# EAGLE design controller_singleSided (EAGLE 5.06)
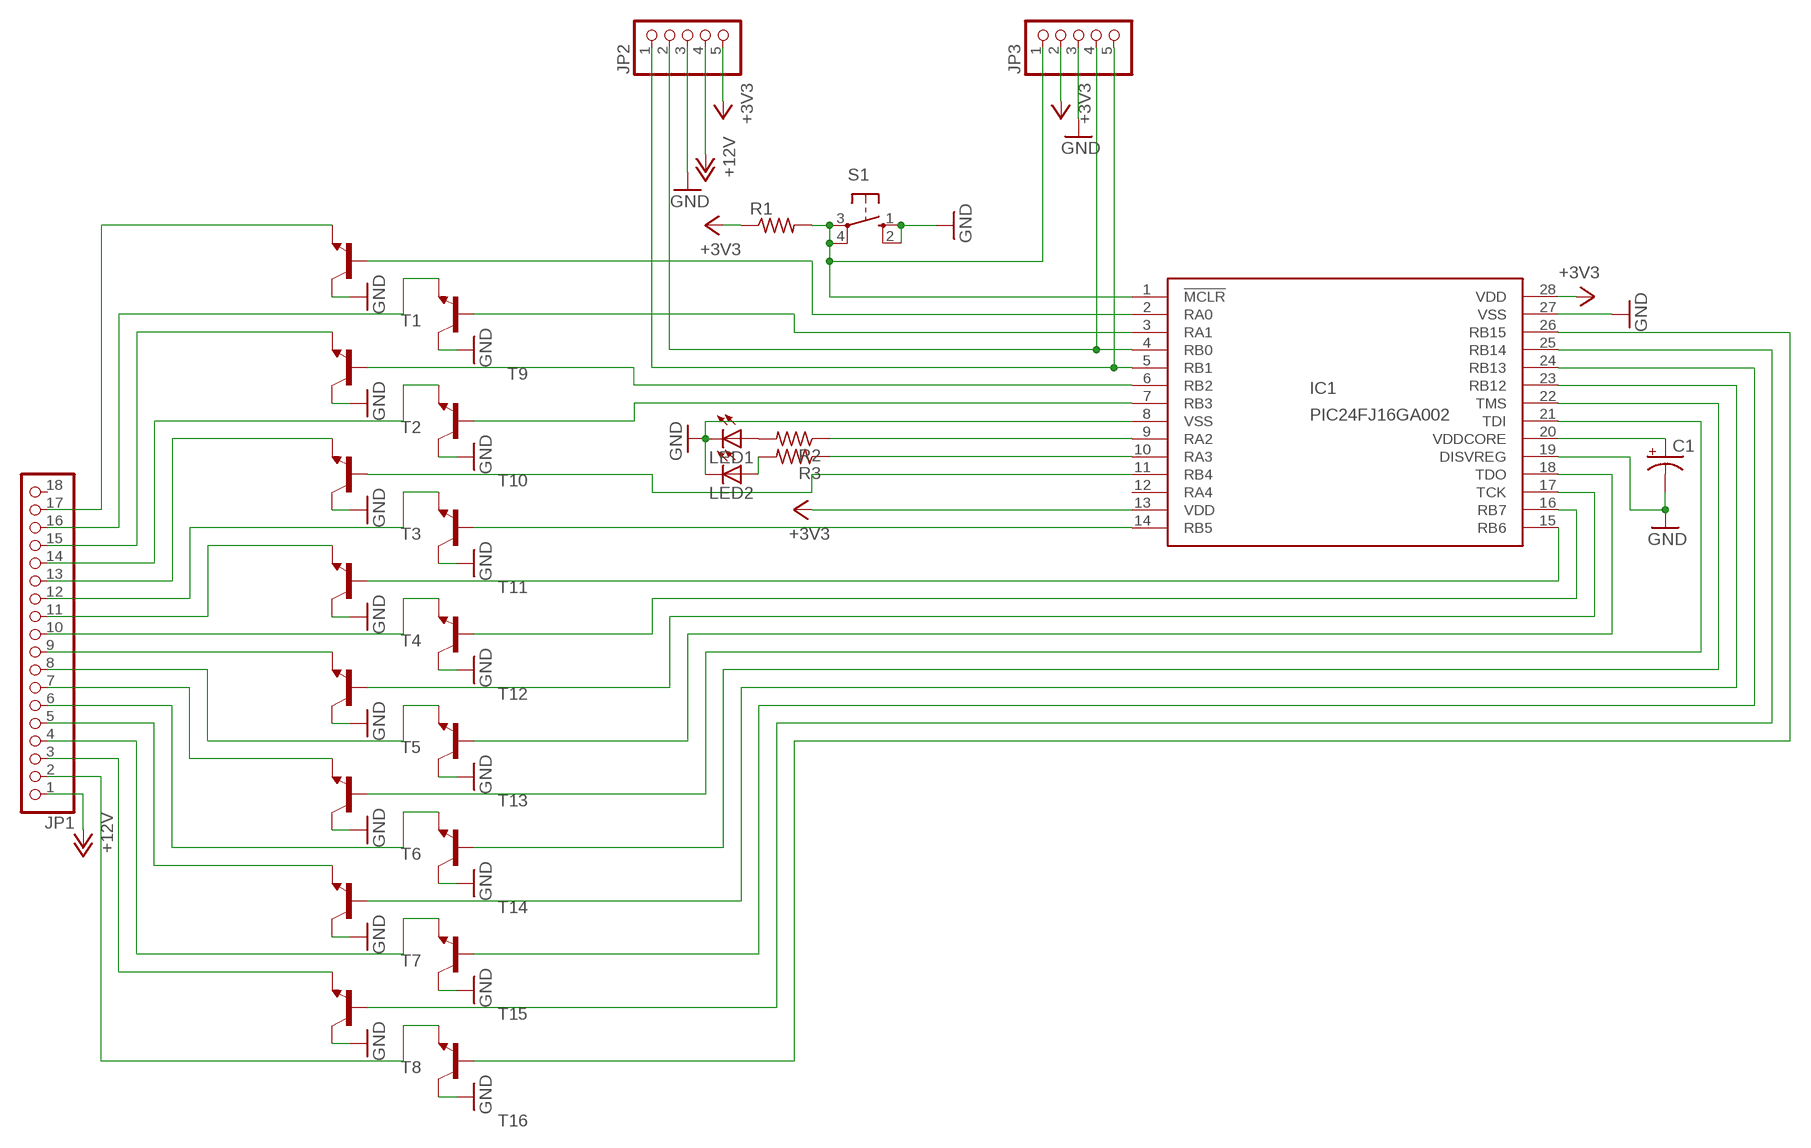
[diagram p0: schematic, sheet 1]

## Parts
C1  CPOL-USE1.8-4  [E1,8-4]
IC1  PIC24FJ16GA002  [DIL28-3]
JP1  PINHD-1X18  [1X18]
JP2  PINHD-1X5  [1X05]
JP3  PINHD-1X5  [1X05]
LED1  LED3MM  [LED3MM]
LED2  LED3MM  [LED3MM]
R1  R-US_0207/10  [0207/10]
R2  R-US_0207/10  [0207/10]
R3  R-US_0207/10  [0207/10]
S1  10-XX  [B3F-10XX]
T1  MPS2222A-NPN-TO92-CBE  [TO92-CBE]
T2  MPS2222A-NPN-TO92-CBE  [TO92-CBE]
T3  MPS2222A-NPN-TO92-CBE  [TO92-CBE]
T4  MPS2222A-NPN-TO92-CBE  [TO92-CBE]
T5  MPS2222A-NPN-TO92-CBE  [TO92-CBE]
T6  MPS2222A-NPN-TO92-CBE  [TO92-CBE]
T7  MPS2222A-NPN-TO92-CBE  [TO92-CBE]
T8  MPS2222A-NPN-TO92-CBE  [TO92-CBE]
T9  MPS2222A-NPN-TO92-CBE  [TO92-CBE]
T10  MPS2222A-NPN-TO92-CBE  [TO92-CBE]
T11  MPS2222A-NPN-TO92-CBE  [TO92-CBE]
T12  MPS2222A-NPN-TO92-CBE  [TO92-CBE]
T13  MPS2222A-NPN-TO92-CBE  [TO92-CBE]
T14  MPS2222A-NPN-TO92-CBE  [TO92-CBE]
T15  MPS2222A-NPN-TO92-CBE  [TO92-CBE]
T16  MPS2222A-NPN-TO92-CBE  [TO92-CBE]

## Nets
+3V3: IC1.13(VDD) IC1.28(VDD) JP2.5 JP3.2 R1.1
+12V: JP1.1 JP2.4
GND: C1.- IC1.8(VSS) IC1.19(DISVREG) IC1.27(VSS) JP2.3 JP3.3 LED1.K(C) LED2.K(C) S1.1(S) S1.2(S1) T1.C T2.C T3.C T4.C T5.C T6.C T7.C T8.C T9.C T10.C T11.C T12.C T13.C T14.C T15.C T16.C
N$1: IC1.2(RA0) T1.B
N$2: IC1.3(RA1) T9.B
N$3: IC1.6(RB2) T2.B
N$4: IC1.7(RB3) T10.B
N$5: IC1.11(RB4) T3.B
N$6: IC1.14(RB5) T11.B
N$7: IC1.15(RB6) T4.B
N$8: IC1.16(RB7) T12.B
N$9: IC1.17(TCK) T5.B
N$10: IC1.18(TDO) T13.B
N$11: IC1.21(TDI) T6.B
N$12: IC1.22(TMS) T14.B
N$13: IC1.23(RB12) T7.B
N$14: IC1.24(RB13) T15.B
N$15: IC1.25(RB14) T8.B
N$16: IC1.26(RB15) T16.B
N$17: JP1.10 T12.E
N$18: JP1.12 T11.E
N$19: JP1.13 T3.E
N$20: JP1.11 T4.E
N$21: JP1.9 T5.E
N$22: JP1.17 T1.E
N$23: JP1.16 T9.E
N$24: JP1.15 T2.E
N$25: JP1.14 T10.E
N$26: JP1.8 T13.E
N$27: JP1.7 T6.E
N$28: JP1.6 T14.E
N$29: JP1.5 T7.E
N$30: JP1.4 T15.E
N$31: JP1.3 T8.E
N$32: JP1.2 T16.E
N$33: IC1.1(!MCLR) JP3.1 R1.2 S1.3(P) S1.4(P1)
N$34: LED1.A R2.2
N$35: IC1.5(RB1) JP2.1 JP3.5
N$36: IC1.4(RB0) JP2.2 JP3.4
N$37: IC1.9(RA2) R2.1
N$38: C1.+ IC1.20(VDDCORE)
N$39: IC1.10(RA3) R3.1
N$40: LED2.A R3.2
Unconnected: IC1.12(RA4) JP1.18

## Library data of the parts
C1 = rcl:CPOL-US: POLARIZED CAPACITOR, American symbol
IC1 = microchip:PIC24FJ16GA002: PIC24FJ16GA002 edit this description Auto generated by make-symbol-device-package-bsdl.ulp Rev. 25 Source: PIC24FJ16GA002.bsd
JP1 = pinhead:PINHD-1X18: PIN HEADER
JP2 JP3 = pinhead:PINHD-1X5: PIN HEADER
LED1 LED2 = led:LED: LED OSRAM: - CHIPLED LG R971, LG N971, LY N971, LG Q971, LY Q971, LO R971, LY R971 LH N974, LH R974 LS Q976, LO Q976, LY Q976 LO Q996 - Hyper CHIPLED LW Q18S LB Q993, LB Q99A, LB R99A - SideLED LS A670, LO A670, LY A670, LG A670, LP A670 LB A673, LV A673, LT A673, LW A673 LH A674 LY A675 LS A676, LA A676, LO A676, LY A676, LW A676 LS A679, LY A679, LG A679 - Hyper Micro SIDELED® LS Y876, LA Y876, LO Y876, LY Y876 LT Y87S - SmartLED LW L88C, LW L88S LB L89C, LB L89S, LG L890 LS L89K, LO L89K, LY L89K LS L896, LA L896, LO L896, LY L896 - TOPLED LS T670, LO T670, LY T670, LG T670, LP T670 LSG T670, LSP T670, LSY T670, LOP T670, LYG T670 LG T671, LOG T671, LSG T671 LB T673, LV T673, LT T673, LW T673 LH T674 LS T676, LA T676, LO T676, LY T676, LB T676, LH T676, LSB T676, LW T676 LB T67C, LV T67C, LT T67C, LS T67K, LO T67K, LY T67K, LW E67C LS E67B, LA E67B, LO E67B, LY E67B, LB E67C, LV E67C, LT E67C LW T67C LS T679, LY T679, LG T679 LS T770, LO T770, LY T770, LG T770, LP T770 LB T773, LV T773, LT T773, LW T773 LH T774 LS E675, LA E675, LY E675, LS T675 LS T776, LA T776, LO T776, LY T776, LB T776 LHGB T686 LT T68C, LB T68C - Hyper Mini TOPLED® LB M676 - Mini TOPLED Santana® LG M470 LS M47K, LO M47K, LY M47K Source: http://www.osram.convergy.de LUXEON: - LUMILED® LXK2-PW12-R00, LXK2-PW12-S00, LXK2-PW14-U00, LXK2-PW14-V00 LXK2-PM12-R00, LXK2-PM12-S00, LXK2-PM14-U00 LXK2-PE12-Q00, LXK2-PE12-R00, LXK2-PE12-S00, LXK2-PE14-T00, LXK2-PE14-U00 LXK2-PB12-K00, LXK2-PB12-L00, LXK2-PB12-M00, LXK2-PB14-N00, LXK2-PB14-P00, LXK2-PB14-Q00 LXK2-PR12-L00, LXK2-PR12-M00, LXK2-PR14-Q00, LXK2-PR14-R00 LXK2-PD12-Q00, LXK2-PD12-R00, LXK2-PD12-S00 LXK2-PH12-R00, LXK2-PH12-S00 LXK2-PL12-P00, LXK2-PL12-Q00, LXK2-PL12-R00 Source: www.luxeon.com KINGBRIGHT: KA-3528ASYC Source: www.kingbright.com
R1-R3 = resistor:R-US_: RESISTOR, American symbol
S1 = switch-omron:10-XX: OMRON SWITCH
T1-T16 = transistor:*-NPN-: NPN Transistror BF959 corrected 2008.03.06

## Board
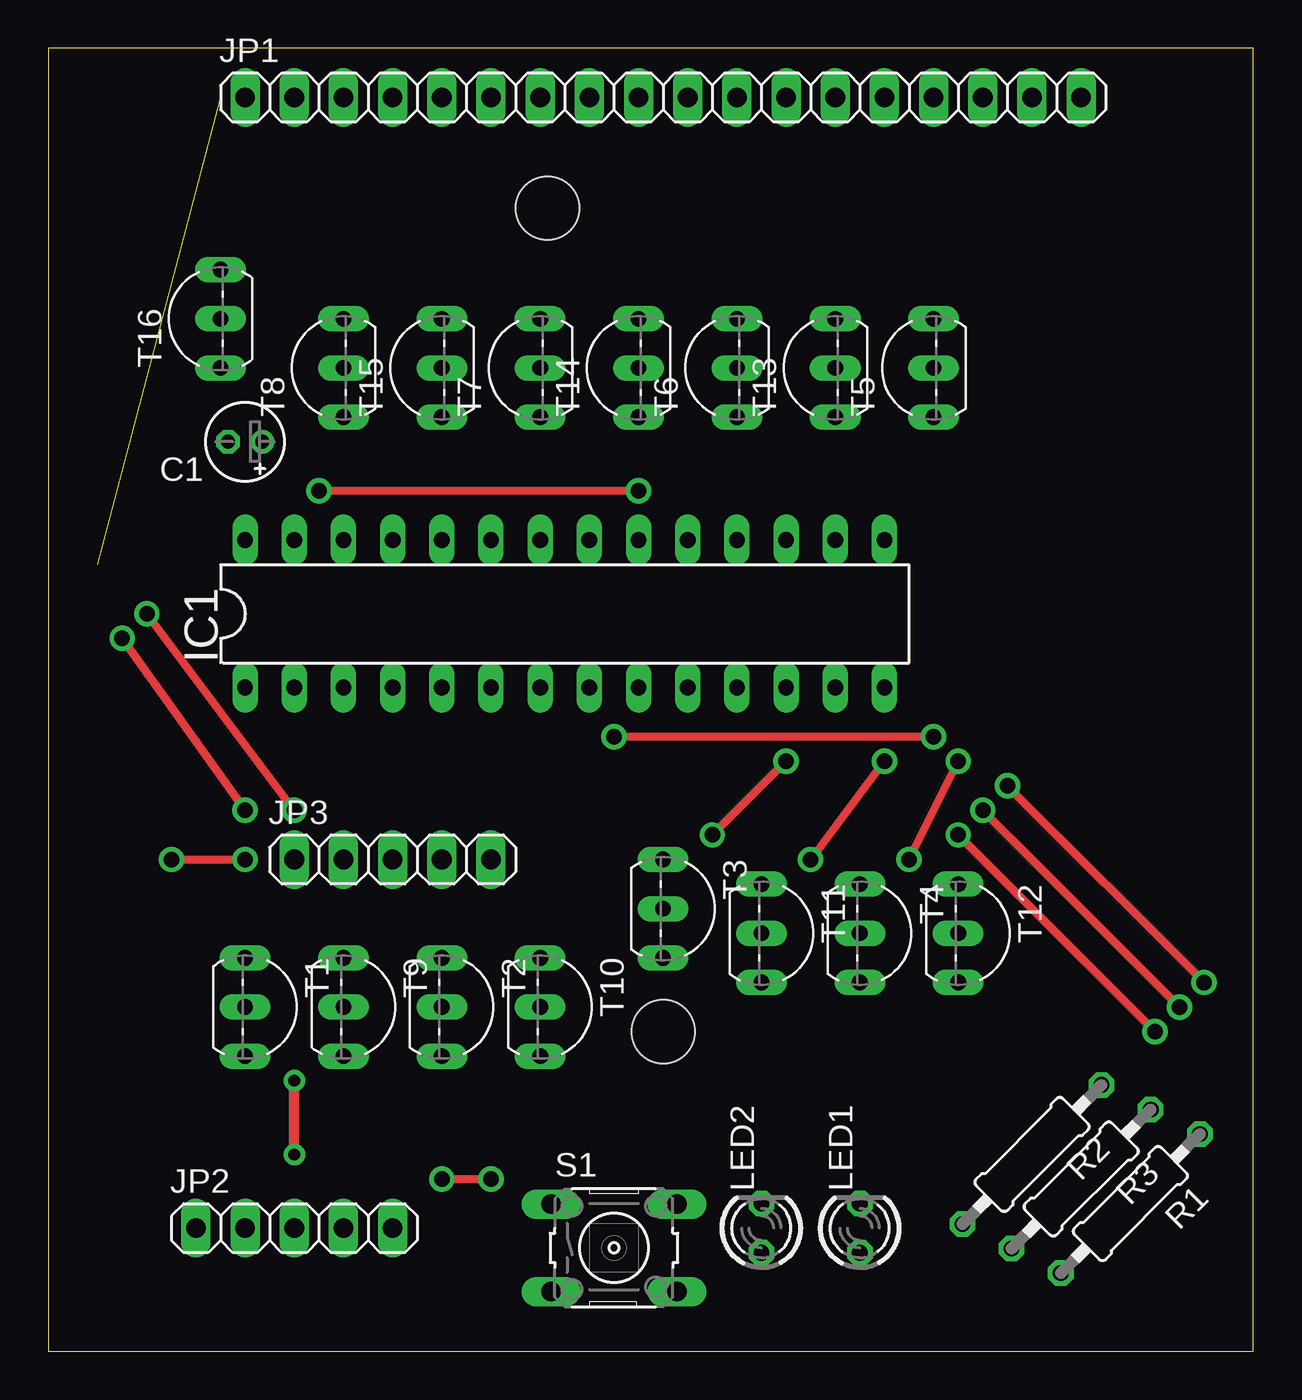
[diagram p1: board, top side]
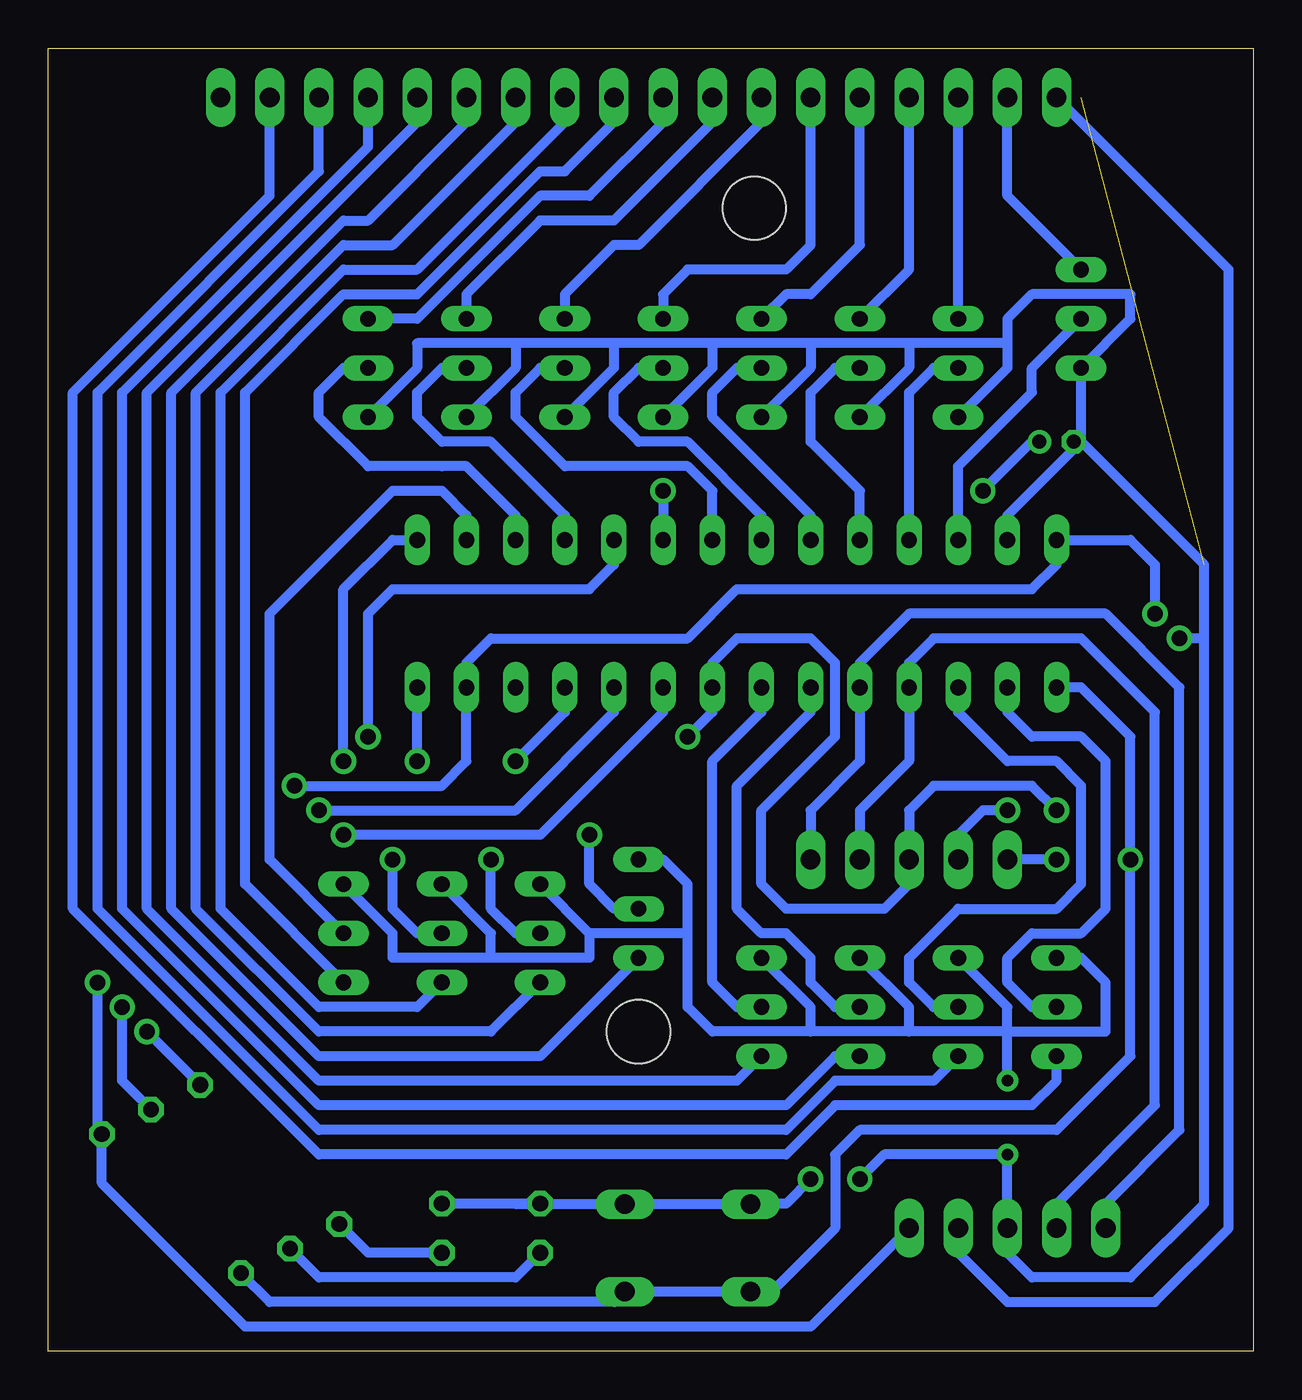
[diagram p2: board, bottom side, seen from below]

Size 62.23 x 67.31 mm. Coordinates in mm from the lower left corner, seen from the top.
Outline: 0,0 62.23,0 62.23,67.31 0,67.31 0,0
Copper layers (1*16): Top 0.035mm / dielectric 1.5mm / Bottom 0.035mm
Design rules "default *": minimum track width 10mil, minimum drill 24mil, track to track 8mil, track to pad 8mil, pad to pad 8mil, via to via 8mil, smd to smd 8mil, copper to edge 40mil, drill to drill 8mil, minimum pad ring 10mil, minimum via ring 10mil, stop-mask expansion 4mil, vias tented up to drill 0mil, thermal gap 10mil
Holes 3.26 mm at 31.75,16.51 25.78,59.05

### Footprints (pad centres in the part's own frame; a part is rotated, then mirrored left to right if it is on the bottom)
E1,8-4 = drill 0.711 pad 1.168 round: + -0.889,0 | drill 0.711 pad 1.168 octagon: - 0.889,0
DIL28-3 = drill 0.813 long: 1 -16.51,-3.81; 2 -13.97,-3.81; 3 -11.43,-3.81; 4 -8.89,-3.81; 5 -6.35,-3.81; 6 -3.81,-3.81; 7 -1.27,-3.81; 8 1.27,-3.81; 9 3.81,-3.81; 10 6.35,-3.81; 11 8.89,-3.81; 12 11.43,-3.81; 13 13.97,-3.81; 14 16.51,-3.81; 15 16.51,3.81; 16 13.97,3.81; 17 11.43,3.81; 18 8.89,3.81; 19 6.35,3.81; 20 3.81,3.81; 21 1.27,3.81; 22 -1.27,3.81; 23 -3.81,3.81; 24 -6.35,3.81; 25 -8.89,3.81; 26 -11.43,3.81; 27 -13.97,3.81; 28 -16.51,3.81
1X18 = drill 1.016 long: 1 -21.59,0; 2 -19.05,0; 3 -16.51,0; 4 -13.97,0; 5 -11.43,0; 6 -8.89,0; 7 -6.35,0; 8 -3.81,0; 9 -1.27,0; 10 1.27,0; 11 3.81,0; 12 6.35,0; 13 8.89,0; 14 11.43,0; 15 13.97,0; 16 16.51,0; 17 19.05,0; 18 21.59,0
1X05 = drill 1.016 long: 1 -5.08,0; 2 -2.54,0; 3 0,0; 4 2.54,0; 5 5.08,0
LED3MM = drill 0.813 octagon: A -1.27,0; K 1.27,0
0207/10 = drill 0.813 octagon: 1 -5.08,0; 2 5.08,0
B3F-10XX = drill 1.016 long: 1 -3.251,2.261; 2 3.251,2.261; 3 -3.251,-2.261; 4 3.251,-2.261
TO92-CBE = drill 0.813 long: B 0,0; C -2.54,0; E 2.54,0

### Placement (x,y rotation side)
C1  10.16,46.99 180 top
IC1  26.67,38.1 0 top
JP1  31.75,64.77 0 top
JP2  12.7,6.35 0 top
JP3  17.78,25.4 0 top
LED1  41.91,6.35 90 top
LED2  36.83,6.35 90 top
R1  55.88,7.62 225 top
R2  50.8,10.16 225 top
R3  53.34,8.89 225 top
S1  29.21,5.33 0 top
T1  10.16,17.78 270 top
T2  20.32,17.78 270 top
T3  31.75,22.86 270 top
T4  41.91,21.59 270 top
T5  45.72,50.8 90 top
T6  35.56,50.8 90 top
T7  25.4,50.8 90 top
T8  15.24,50.8 90 top
T9  15.24,17.78 270 top
T10  25.4,17.78 270 top
T11  36.83,21.59 270 top
T12  46.99,21.59 270 top
T13  40.64,50.8 90 top
T14  30.48,50.8 90 top
T15  20.32,50.8 90 top
T16  8.89,53.34 90 top

### Tracks (layer width: path | path; a pad name or v marks a point on that pad's centre or on a via)
+3V3  (via drill 0.8)
  Top 0.406: v59.69,19.05 v49.53,29.21 | v5.08,38.1 v12.7,27.94
  Bottom 0.508: JP2.5 22.86,1.27 52.07,1.27 59.47,8.67 R1.1 59.69,11.43 v59.69,19.05 | v49.53,29.21 41.91,29.21 40.64,30.48 IC1.13 40.64,35.56 39.37,36.83 29.21,36.83 26.67,39.37 11.43,39.37 10.16,40.64 IC1.28 6.35,41.91 5.08,40.64 v5.08,38.1 | v12.7,27.94 13.97,27.94 15.24,26.67 JP3.2
+12V
  Bottom 0.508: JP2.4 15.24,5.08 12.7,2.54 5.08,2.54 1.27,6.35 1.27,55.88 JP1.1
GND  (via drill 0.6, 0.8)  (1 unrouted)
  Top 0.406: v20.32,8.89 v22.86,8.89 | v29.21,31.75 v45.72,31.75 | v3.81,36.83 v10.16,27.94
  Top 0.508: v12.7,10.16 v12.7,13.97
  Bottom 0.508: C1.- 9.27,46.61 12.7,43.18 IC1.27 | LED1.K LED2.K 38.08,7.59 S1.2 S1.1 25.93,7.62 24.13,7.62 v22.86,8.89 | 2.54,36.83 2.54,7.62 6.35,3.81 11.43,3.81 12.7,5.08 JP2.3 v12.7,10.16 19.05,10.16 v20.32,8.89 | IC1.19 33.02,40.64 34.29,39.37 44.45,39.37 45.72,38.1 v45.72,31.75 | v29.21,31.75 27.94,33.02 IC1.8 27.94,35.56 26.67,36.83 22.86,36.83 21.59,35.56 21.59,31.75 25.4,27.94 25.4,24.13 24.13,22.86 19.05,22.86 17.78,24.13 JP3.3 17.78,27.94 16.51,29.21 11.43,29.21 v10.16,27.94 | 2.54,36.83 v3.81,36.83 | C1.- 8.89,46.99 2.54,40.64 2.54,36.83 | T9.C 12.7,17.78 12.7,16.51 | T3.C 30.48,25.4 29.21,24.13 29.21,21.59 | 34.29,21.59 T11.C | T4.C 39.37,21.59 39.37,20.32 | v12.7,13.97 12.7,16.51 | T1.C 8.89,20.32 7.62,19.05 7.62,16.51 12.7,16.51 | T2.C 17.78,17.78 17.78,16.51 | 12.7,16.51 17.78,16.51 | T10.C 22.86,17.78 22.86,16.51 | 17.78,16.51 22.86,16.51 | 29.21,21.59 29.21,17.78 27.94,16.51 22.86,16.51 | 29.21,21.59 34.29,21.59 | 39.37,20.32 34.29,20.32 34.29,21.59 | T12.C 44.45,21.59 44.45,20.32 39.37,20.32 | T5.C 43.18,50.8 43.18,52.07 38.1,52.07 | 38.1,52.07 38.1,50.8 T13.C | T6.C 33.02,50.8 33.02,52.07 | 33.02,52.07 38.1,52.07 | T14.C 27.94,50.8 27.94,52.07 | 27.94,52.07 33.02,52.07 | T7.C 22.86,50.8 22.86,52.07 | 22.86,52.07 27.94,52.07 | T15.C 17.78,50.8 17.78,52.07 | 17.78,52.07 22.86,52.07 | T8.C 12.7,50.8 12.7,52.07 | 12.7,52.07 17.78,52.07 | C1.- 8.89,47.37 T16.C 6.35,53.34 6.35,54.61 11.43,54.61 12.7,53.34 12.7,52.07
N$1
  Bottom 0.508: IC1.2 12.7,33.02 11.43,31.75 8.89,31.75 7.62,30.48 7.62,22.86 8.89,21.59 11.43,21.59 12.7,20.32 12.7,19.05 11.43,17.78 T1.B
N$2
  Bottom 0.508: IC1.3 15.24,33.02 12.7,30.48 10.16,30.48 8.89,29.21 8.89,24.13 10.16,22.86 15.24,22.86 17.78,20.32 17.78,19.05 16.51,17.78 T9.B
N$3
  Bottom 0.508: T2.B 21.59,17.78 22.86,19.05 22.86,20.32 24.13,21.59 25.4,21.59 26.67,22.86 26.67,29.21 22.86,33.02 IC1.6
N$4
  Bottom 0.508: T10.B 26.67,17.78 27.94,19.05 27.94,30.48 25.4,33.02 IC1.7
N$5  (via drill 0.8)
  Top 0.406: v34.29,26.67 v38.1,30.48
  Bottom 0.508: IC1.11 35.56,33.02 v38.1,30.48 | v34.29,26.67 34.29,24.13 33.02,22.86 T3.B
N$6  (via drill 0.8)
  Top 0.406: v39.37,25.4 v43.18,30.48
  Bottom 0.508: v43.18,30.48 IC1.14 | v39.37,25.4 39.37,22.86 38.1,21.59 T11.B
N$7  (via drill 0.8)
  Top 0.406: v44.45,25.4 v46.99,30.48
  Bottom 0.508: T4.B 43.18,21.59 44.45,22.86 v44.45,25.4 | v46.99,30.48 46.99,39.37 44.45,41.91 IC1.15
N$8
  Bottom 0.508: T12.B 50.8,25.4 50.8,38.1 44.45,44.45 41.91,44.45 40.64,43.18 IC1.16
N$9
  Bottom 0.508: T5.B 46.99,50.8 48.26,49.53 48.26,48.26 45.72,45.72 41.91,45.72 40.64,45.72 38.1,43.18 IC1.17
N$10
  Bottom 0.508: T13.B 41.91,50.8 43.18,49.53 43.18,48.26 41.91,46.99 39.37,46.99 35.56,43.18 IC1.18
N$11
  Bottom 0.508: T6.B 36.83,50.8 38.1,49.53 38.1,48.26 35.56,45.72 29.21,45.72 27.94,44.45 IC1.21
N$12
  Bottom 0.508: T14.B 31.75,50.8 33.02,49.53 33.02,48.26 31.75,46.99 29.21,46.99 25.4,43.18 IC1.22
N$13
  Bottom 0.508: T7.B 26.67,50.8 27.94,49.53 27.94,48.26 22.86,43.18 IC1.23
N$14
  Bottom 0.508: T15.B 21.59,50.8 22.86,49.53 22.86,46.99 20.32,44.45 IC1.24
N$15
  Bottom 0.508: T8.B 16.51,50.8 17.78,49.53 IC1.25
N$16
  Bottom 0.508: T16.B 11.43,50.8 11.43,49.53 15.24,45.72 IC1.26
N$17
  Bottom 0.508: T12.E 52.07,24.13 52.07,49.53 46.99,54.61 43.18,54.61 36.83,60.96 35.56,60.96 33.02,63.5 JP1.10
N$18
  Bottom 0.508: T11.E 39.37,16.51 48.26,16.51 54.61,22.86 54.61,49.53 46.99,57.15 44.45,57.15 38.1,63.5 JP1.12
N$19
  Bottom 0.508: T3.E 36.83,15.24 48.26,15.24 55.88,22.86 55.88,49.53 46.99,58.42 45.72,58.42 40.64,63.5 JP1.13
N$20
  Bottom 0.508: T4.E 43.18,17.78 48.26,17.78 53.34,22.86 53.34,49.53 46.99,55.88 43.18,55.88 35.56,63.5 JP1.11
N$21
  Bottom 0.508: T5.E 43.18,53.34 36.83,59.69 34.29,59.69 30.48,63.5 JP1.9
N$22
  Bottom 0.508: T1.E 10.16,13.97 11.43,12.7 21.59,12.7 24.13,10.16 48.26,10.16 60.96,22.86 60.96,49.53 50.8,59.69 JP1.17
N$23
  Bottom 0.508: T9.E 16.51,13.97 21.59,13.97 24.13,11.43 48.26,11.43 59.69,22.86 59.69,49.53 48.26,60.96 JP1.16
N$24
  Bottom 0.508: T2.E 21.59,15.24 24.13,12.7 48.26,12.7 58.42,22.86 58.42,49.53 45.72,62.23 JP1.15
N$25
  Bottom 0.508: T10.E 26.67,13.97 48.26,13.97 57.15,22.86 57.15,49.53 43.18,63.5 JP1.14
N$26
  Bottom 0.508: T13.E 40.64,54.61 36.83,58.42 33.02,58.42 27.94,63.5 JP1.8
N$27
  Bottom 0.508: T6.E 35.56,54.61 33.02,57.15 31.75,57.15 25.4,63.5 JP1.7
N$28
  Bottom 0.508: T14.E 30.48,54.61 29.21,55.88 24.13,55.88 22.86,57.15 JP1.6
N$29
  Bottom 0.508: T7.E 24.13,54.61 22.86,54.61 20.32,57.15 JP1.5
N$30
  Bottom 0.508: T15.E 17.78,55.88 JP1.4
N$31
  Bottom 0.508: T8.E JP1.3
N$32
  Bottom 0.508: T16.E 12.7,59.69 JP1.2
N$33  (via drill 0.8)
  Top 0.406: v6.35,25.4 v10.16,25.4
  Bottom 0.508: v10.16,25.4 JP3.1 | IC1.1 8.89,34.29 6.35,31.75 v6.35,25.4 6.35,15.24 10.16,11.43 20.32,11.43 21.59,10.16 21.59,6.35 24.87,3.07 S1.3 S1.4 32.99,2.54 50.8,2.54 R1.2
N$34
  Bottom 0.508: LED1.A 45.72,5.08 R2.2
N$35
  Bottom 0.508: JP3.5 22.86,27.94 20.32,30.48 IC1.5 20.32,35.56 17.78,38.1 7.62,38.1 3.81,34.29 3.81,11.43 7.62,7.62 JP2.1
N$36
  Bottom 0.508: JP3.4 20.32,27.94 17.78,30.48 IC1.4 17.78,35.56 16.51,36.83 8.89,36.83 5.08,33.02 5.08,12.7 10.16,7.62 JP2.2
N$37  (via drill 0.8)
  Top 0.406: v46.99,26.67 v57.15,16.51
  Bottom 0.508: v46.99,26.67 36.83,26.67 30.48,33.02 IC1.9 | v57.15,16.51 R2.1
N$38  (via drill 0.8)
  Top 0.406: v13.97,44.45 v30.48,44.45
  Bottom 0.508: C1.+ 11.43,46.99 v13.97,44.45 | v30.48,44.45 IC1.20
N$39  (via drill 0.8)
  Top 0.406: v58.42,17.78 v48.26,27.94
  Bottom 0.508: IC1.10 33.02,33.02 38.1,27.94 v48.26,27.94 | R3.1 58.42,13.97 v58.42,17.78
N$40
  Bottom 0.508: LED2.A 38.1,3.81 48.26,3.81 R3.2

### Text on the board
tValues: GND | Alex Crawford, 2009 | ICSP | + | Reset | Aux. | Atten. | Power/Comm